# Altium schematic sheet BoostConverter.SchDoc
size A
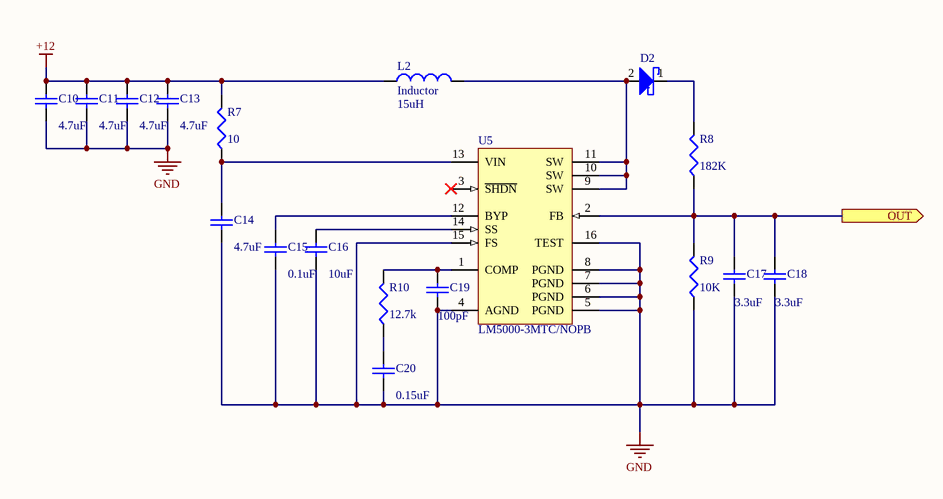
[diagram p0: BoostConverter.SchDoc]

## Parts
C10  Cap  [C0805]  (value not drawn)
C11  Cap  [C0805]  (value not drawn)
C12  Cap  [C0805]  (value not drawn)
C13  Cap  [C0805]  (value not drawn)
C14  Cap  [C0805]  (value not drawn)
C15  Cap  [C0805]  (value not drawn)
C16  Cap  [C0805]  (value not drawn)
C17  Cap  [C0805]  (value not drawn)
C18  Cap  [C0805]  (value not drawn)
C19  Cap  [C0805]  (value not drawn)
C20  Cap  [C0805]  (value not drawn)
D2  Schottky Diode  [DIOM4326X24N]  (value not drawn)
L2  Inductor  value 15uH  [INDC4532]
R7  value 10  [J1-0603]  (hidden comment: Res3)
R8  value 182K  [J1-0603]  (hidden comment: Res3)
R9  value 10K  [J1-0603]  (hidden comment: Res3)
R10  value 12.7k  [6-0805_L]  (hidden comment: Res3)
U5  LM5000-3MTC/NOPB  [PW0016A_L]

## Ports
OUT (out)

## Nets
+12: C10.2 C11.2 C12.2 C13.2 L2.1 R7.2
GND: C10.1 C11.1 C12.1 C13.1 C14.1 C15.1 C16.1 C17.1 C18.1 C19.1 C20.1 R9.1 U5.4(AGND) U5.5(PGND) U5.6(PGND) U5.7(PGND) U5.8(PGND) U5.15(FS) U5.16(TEST)
OUT: C17.2 C18.2 R8.1 R9.2 U5.2(FB) ; port OUT
NetC14_2: C14.2 R7.1 U5.13(VIN)
NetC15_2: C15.2 U5.12(BYP)
NetC16_2: C16.2 U5.14(SS)
NetC19_2: C19.2 R10.2 U5.1(COMP)
NetC20_2: C20.2 R10.1
NetD2_1: D2.1 R8.2
NetD2_2: D2.2 L2.2 U5.9(SW) U5.10(SW) U5.11(SW)

Not connected (* = marked no-connect by the designer): U5 3(~{SHDN})*

## Notes on the sheet
- (in symbol Cap) 4.7uF; 0.1uF; 10uF; 100pF; 0.15uF; 3.3uF

## Library data of the parts
C10-C20 = Cap: Capacitor; Published: 8-Jun-2000; LatestRevisionDate: 17-Jul-2002; LatestRevisionNote: Re-released for DXP Platform.; PackageReference: RAD-0.3; Publisher: Altium Limited; PackageDescription: Radial Cap, Thru-Hole; 2 Leads; 0.3 in Pin Spacing
D2 = B160-13-F
L2 = Inductor: Code_IEC: 1005; Published: 8-Jun-2000; LatestRevisionDate: 29-May-2009; LatestRevisionNote: IPC-7351 Footprint Added.; PackageReference: 0402-A; Publisher: Altium Limited; PackageDescription: Chip Inductor; Code_JEITA: 0402
R7-R10 = Res3: Resistor; Published: 8-Jun-2000; LatestRevisionDate: 29-May-2009; LatestRevisionNote: IPC-7351 Footprint Added.; PackageReference: J1-0603; Publisher: Altium Limited; PackageDescription: Chip Resistor
U5 = CMP-0069-01337-3: High Voltage Switch Mode Regulator, 16-pin TSSOP, Pb-Free; Manufacturer: Texas Instruments; PowerWise: N; CompType: Switcher; PackageTopMarking: NSZXYTT*LM5000*3MTC; PackageReference: PW0016A; Code_JEDEC: MO-153-AB; PinCount: 16; RoHS: Y; ComponentLink1URL: http://www.ti.com/general/docs/lit/getliterature.tsp?genericPartNumber=LM5000&fileType=pdf; PackageDescription: Molded TSSOP, Jedec, 5 x 4.4 x 0.9mm Body, 16 Lead, 0.65mm Pitch; ComponentLink1Description: Datasheet URL